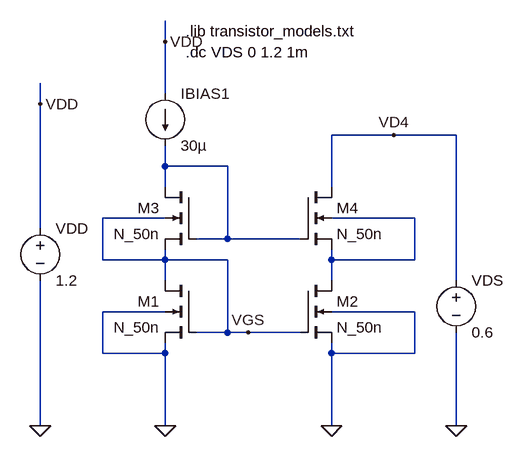
[diagram p0: schematic lab08_nmos_cascode_mirror.asc]
lab08_nmos_cascode_mirror.asc, the LTspice schematic file:
Version 4
SHEET 1 1184 680
WIRE 80 -240 80 -272
WIRE 80 -160 80 -240
WIRE -112 -144 -112 -176
WIRE 432 -96 336 -96
WIRE 528 -96 432 -96
WIRE 80 -48 80 -80
WIRE 176 -48 80 -48
WIRE 80 -16 80 -48
WIRE 336 -16 336 -96
WIRE 80 32 -16 32
WIRE 464 32 336 32
WIRE -112 48 -112 -144
WIRE 176 64 176 -48
WIRE 176 64 128 64
WIRE 288 64 176 64
WIRE -16 96 -16 32
WIRE 80 96 80 80
WIRE 80 96 -16 96
WIRE 176 96 80 96
WIRE 336 96 336 80
WIRE 464 96 464 32
WIRE 464 96 336 96
WIRE 80 128 80 96
WIRE 336 128 336 96
WIRE 528 128 528 -96
WIRE 80 176 -16 176
WIRE 464 176 336 176
WIRE 176 208 176 96
WIRE 176 208 128 208
WIRE 208 208 176 208
WIRE 288 208 208 208
WIRE -16 240 -16 176
WIRE 80 240 80 224
WIRE 80 240 -16 240
WIRE 336 240 336 224
WIRE 464 240 464 176
WIRE 464 240 336 240
WIRE -112 352 -112 128
WIRE 80 352 80 240
WIRE 336 352 336 240
WIRE 528 352 528 208
FLAG 80 352 0
FLAG -112 352 0
FLAG -112 -144 VDD
FLAG 80 -240 VDD
FLAG 336 352 0
FLAG 528 352 0
FLAG 208 208 VGS
FLAG 432 -96 VD4
SYMBOL nmos4 128 128 M0
SYMATTR InstName M1
SYMATTR Value2 l=1u w=10u
SYMATTR Value N_50n
SYMBOL current 80 -160 R0
WINDOW 123 0 0 Left 0
WINDOW 39 0 0 Left 0
SYMATTR InstName IBIAS1
SYMATTR Value 30µ
SYMBOL voltage -112 32 R0
WINDOW 123 0 0 Left 0
WINDOW 39 0 0 Left 0
SYMATTR InstName VDD
SYMATTR Value 1.2
SYMBOL nmos4 288 128 R0
SYMATTR InstName M2
SYMATTR Value2 l=1u w=10u
SYMATTR Value N_50n
SYMBOL voltage 528 112 R0
WINDOW 123 0 0 Left 0
WINDOW 39 0 0 Left 0
SYMATTR InstName VDS
SYMATTR Value 0.6
SYMBOL nmos4 128 -16 M0
SYMATTR InstName M3
SYMATTR Value2 l=1u w=10u
SYMATTR Value N_50n
SYMBOL nmos4 288 -16 R0
SYMATTR InstName M4
SYMATTR Value2 l=1u w=10u
SYMATTR Value N_50n
TEXT 112 -256 Left 2 !.lib transistor_models.txt
TEXT 112 -224 Left 2 !.dc VDS 0 1.2 1m

The netlist it stands for:
* lab08_nmos_cascode_mirror.asc
M1 VGS VGS 0 0 N_50n l=1u w=10u
IBIAS1 VDD N001 30µ
VDD VDD 0 1.2
M2 N002 VGS 0 0 N_50n l=1u w=10u
VDS VD4 0 0.6
M3 N001 N001 VGS VGS N_50n l=1u w=10u
M4 VD4 N001 N002 N002 N_50n l=1u w=10u
.model NMOS NMOS
.model PMOS PMOS
.lib standard.mos
.lib transistor_models.txt
.dc VDS 0 1.2 1m
.backanno
.end

* Results of the author's LTspice run, read from the files saved beside the schematic
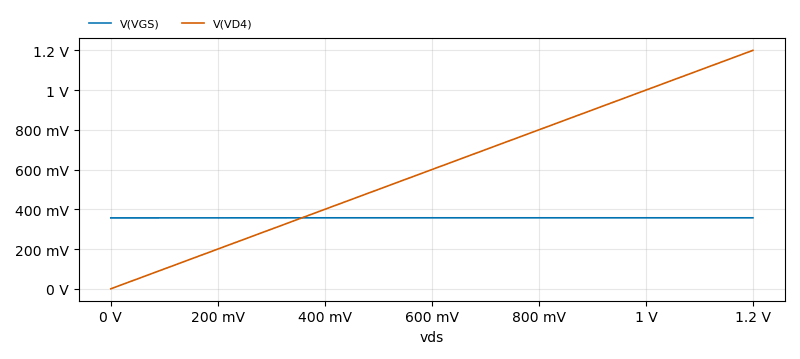
[diagram p1: DC transfer characteristic of lab08_nmos_cascode_mirror.asc, plotted from the saved traces]
* DC transfer characteristic, 1 run:
*   V(VGS): 356.7 mV at vds=0 V, 357.3 mV at vds=1.2 V, min 356.7 mV, max 357.3 mV
*   V(VD4): 0 V at vds=0 V, 1.2 V at vds=1.2 V, min 0 V, max 1.2 V